# Altium project SensorBoard.PrjPcb
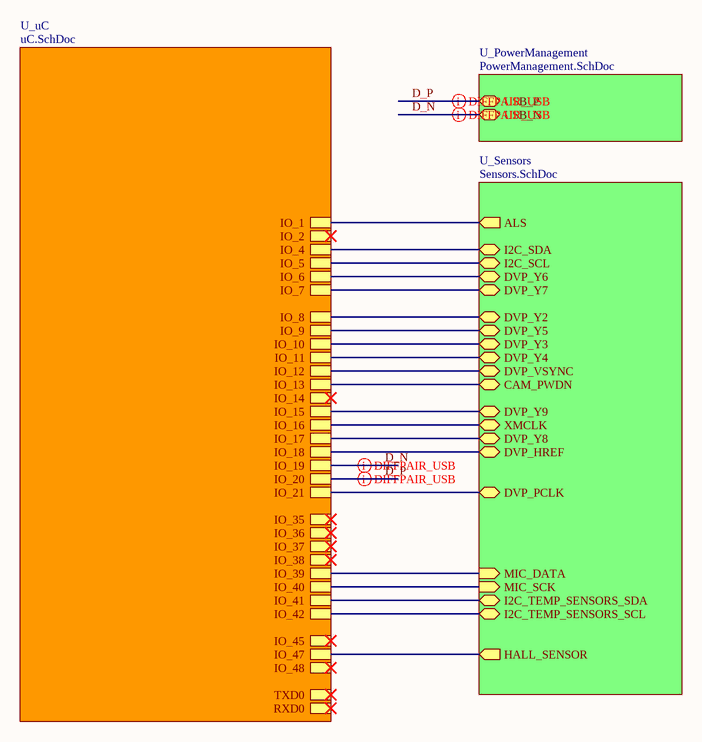
[diagram p0: Main.SchDoc]
Author_in3: Pablo Sanchez Bergasa; SheetTotal_in3: 10
4 sheets, 66 parts. Net scope: hierarchical (ports join the sheet entries above them; power ports are global).
Board file: SensorBoard.PcbDoc
Sheets:
  Main.SchDoc
    U_uC = uC.SchDoc
    U_Sensors = Sensors.SchDoc
    U_PowerManagement = PowerManagement.SchDoc

## Sheet Main.SchDoc: Main
size A3; Date: 17/09/18; Author: Pablo Sánchez Bergasa; Revision: 2.A.1; SheetNumber: 1; SheetTotal: 4; DocumentName: Main

### Sub-sheets
U_PowerManagement = PowerManagement.SchDoc: USB_P (bidir), USB_N (bidir)
U_Sensors = Sensors.SchDoc: MIC_SCK (in), MIC_DATA (in), I2C_SDA (bidir), I2C_SCL (bidir), ALS (out), I2C_TEMP_SENSORS_SDA (bidir), I2C_TEMP_SENSORS_SCL (bidir), HALL_SENSOR (out), DVP_VSYNC (bidir), DVP_HREF (bidir), DVP_Y2 (bidir), DVP_Y3 (bidir), DVP_Y7 (bidir), DVP_Y9 (bidir), XMCLK (bidir), DVP_PCLK (bidir), DVP_Y4 (bidir), DVP_Y6 (bidir), CAM_PWDN (bidir), DVP_Y8 (bidir), DVP_Y5 (bidir)
U_uC = uC.SchDoc: IO_4, IO_5, IO_35, IO_6, IO_7, IO_8, IO_9, IO_10, IO_11, IO_12, IO_13, IO_14, IO_15, IO_16, IO_17, IO_18, IO_19, IO_20, IO_21, IO_36, IO_37, IO_38, IO_1, IO_2, TXD0, RXD0, IO_39, IO_40, IO_41, IO_42, IO_47, IO_48, IO_45

### Nets
D_N: sheet U_uC/IO_19, sheet U_PowerManagement/USB_N
D_P: sheet U_uC/IO_20, sheet U_PowerManagement/USB_P
SCL: sheet U_uC/IO_5, sheet U_Sensors/I2C_SCL
SCL_TS: sheet U_uC/IO_42, sheet U_Sensors/I2C_TEMP_SENSORS_SCL
SDA: sheet U_uC/IO_4, sheet U_Sensors/I2C_SDA
SDA_TS: sheet U_uC/IO_41, sheet U_Sensors/I2C_TEMP_SENSORS_SDA
NetJ2_3: sheet U_uC/IO_11, sheet U_Sensors/DVP_Y4
NetJ2_4: sheet U_uC/IO_10, sheet U_Sensors/DVP_Y3
NetJ2_5: sheet U_uC/IO_9, sheet U_Sensors/DVP_Y5
NetJ2_6: sheet U_uC/IO_8, sheet U_Sensors/DVP_Y2
NetJ2_7: sheet U_uC/IO_6, sheet U_Sensors/DVP_Y6
NetJ2_8: sheet U_uC/IO_21, sheet U_Sensors/DVP_PCLK
NetJ2_9: sheet U_uC/IO_7, sheet U_Sensors/DVP_Y7
NetJ2_11: sheet U_uC/IO_17, sheet U_Sensors/DVP_Y8
NetJ2_12: sheet U_uC/IO_16, sheet U_Sensors/XMCLK
NetJ2_13: sheet U_uC/IO_15, sheet U_Sensors/DVP_Y9
NetJ2_16: sheet U_uC/IO_18, sheet U_Sensors/DVP_HREF
NetJ2_17: sheet U_uC/IO_13, sheet U_Sensors/CAM_PWDN
NetJ2_18: sheet U_uC/IO_12, sheet U_Sensors/DVP_VSYNC
NetR7_2: sheet U_uC/IO_1, sheet U_Sensors/ALS
NetU1_24: sheet U_uC/IO_47, sheet U_Sensors/HALL_SENSOR
NetU1_32: sheet U_uC/IO_39, sheet U_Sensors/MIC_DATA
NetU1_33: sheet U_uC/IO_40, sheet U_Sensors/MIC_SCK

### Layout directives
differential pair; differential pair class USB: D_N, D_P

### Notes on the sheet
- Title
- Size:
- Date:
- A3
- Author:
- Time:
- Revision:
- Sheet
- of
- File:

## Sheet uC.SchDoc: uC
size A3; SheetNumber: 3; SheetTotal: 4
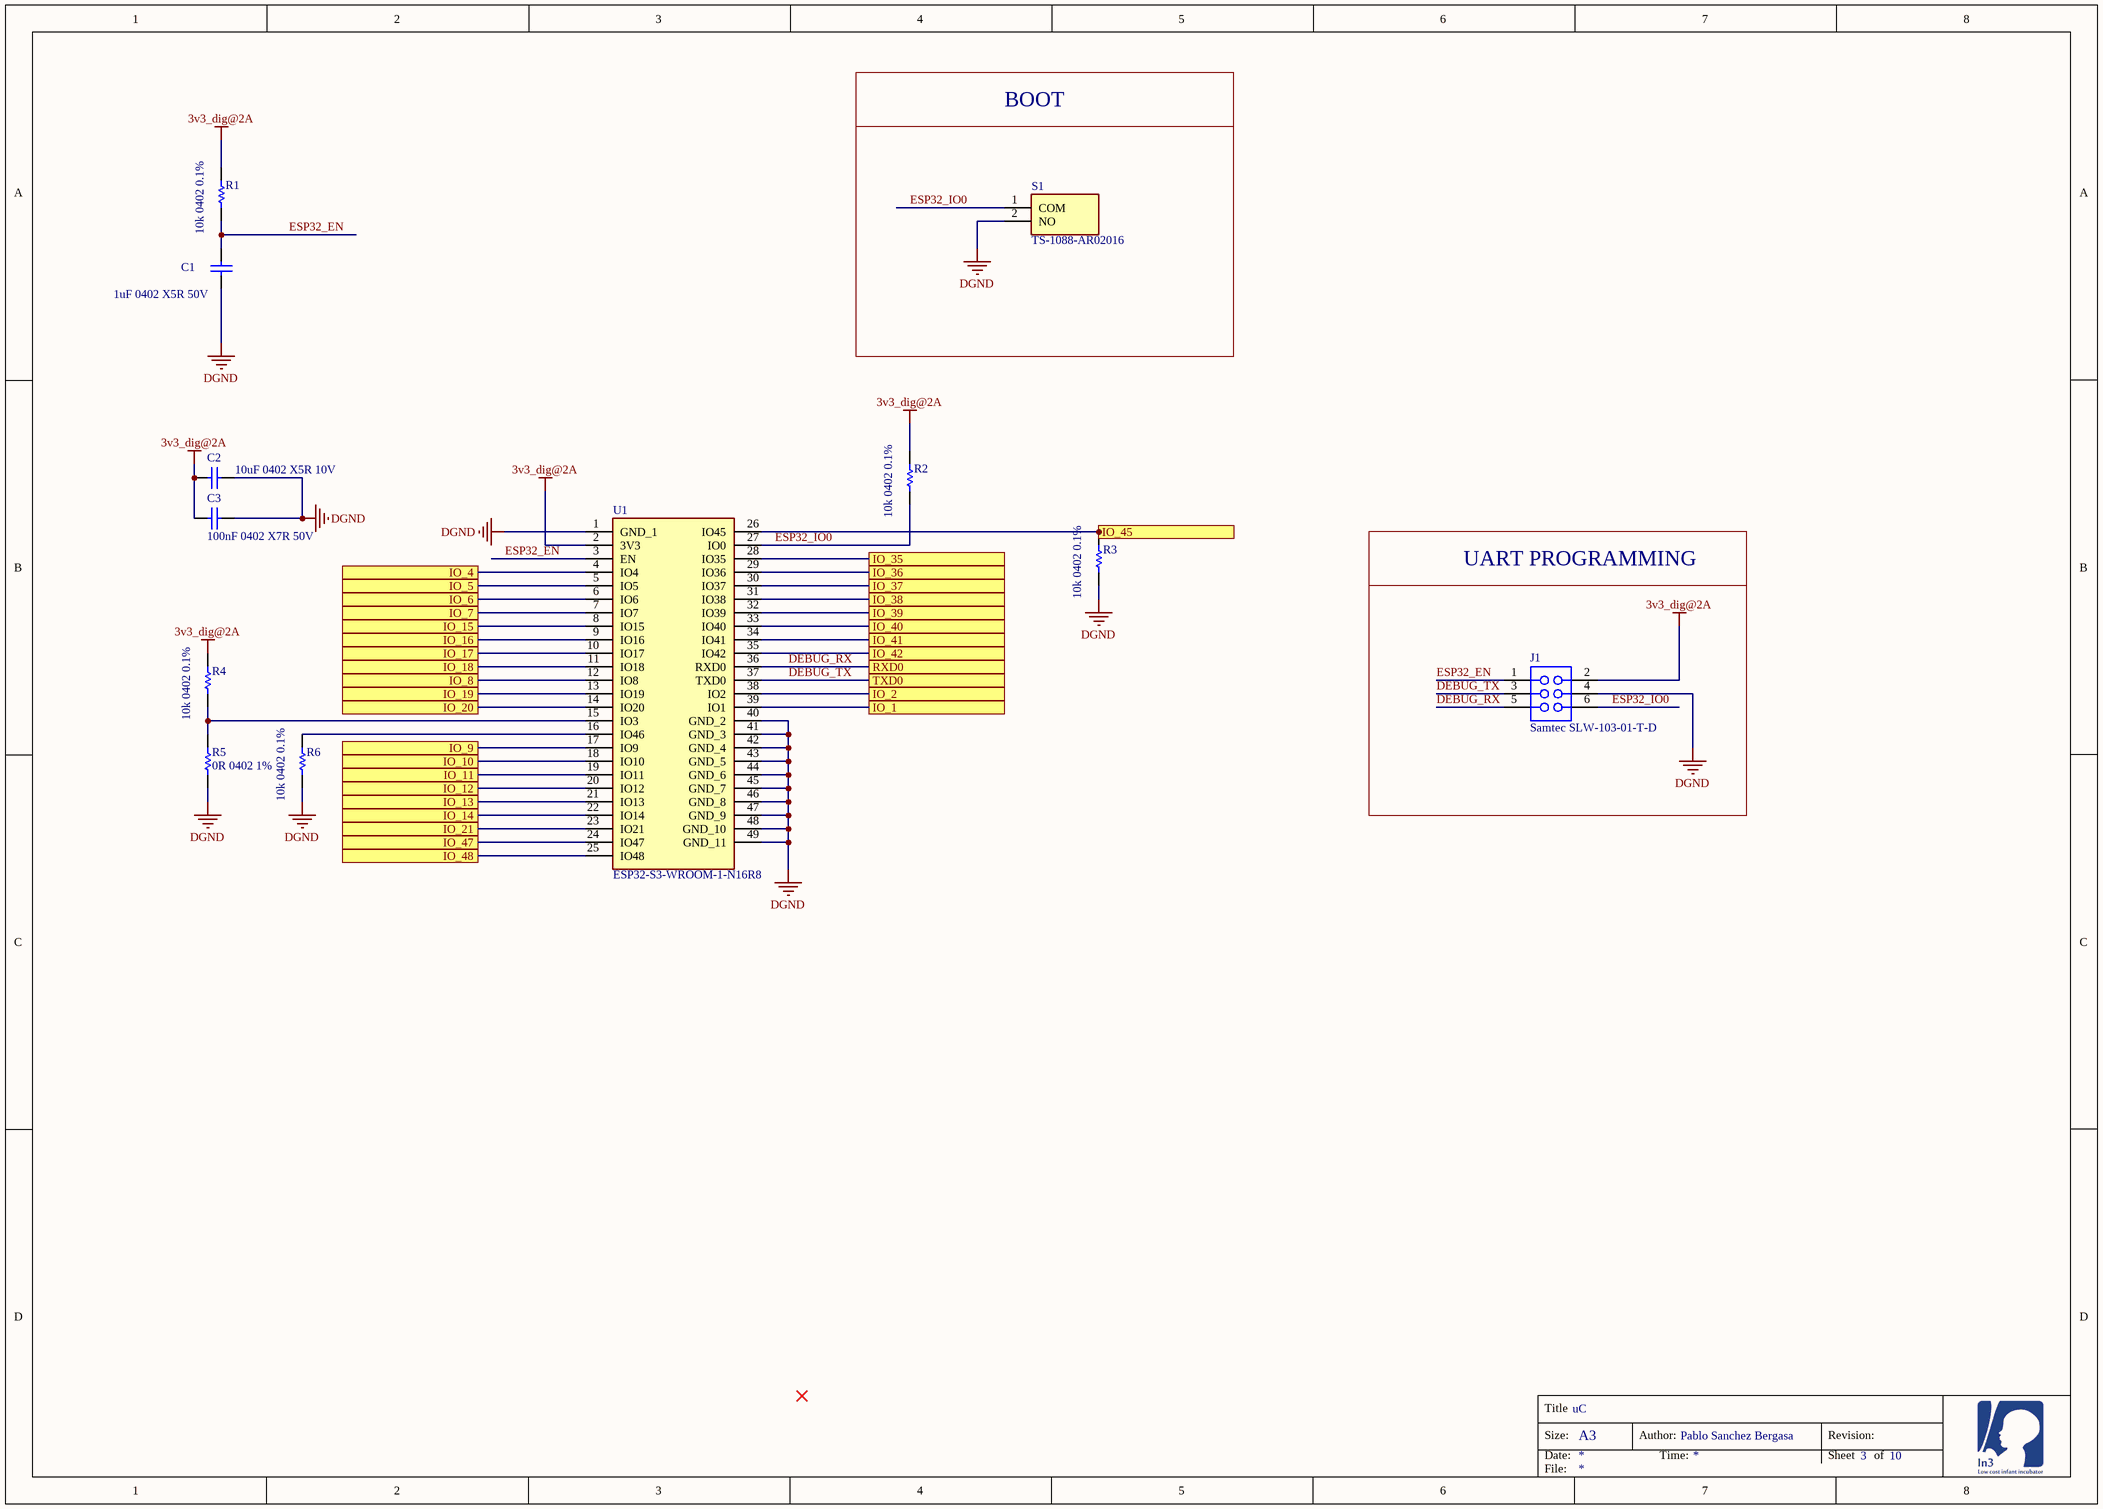
[diagram p1: uC.SchDoc]

### Parts
C1  1uF 0402 X5R 50V  [CAPC1005X55X25NL5T10]
C2  10uF 0402 X5R 10V  [CAPC1005X55X25NL5T10]
C3  100nF 0402 X7R 50V  [CAPC1005X55X25NL5T10]
J1  Samtec SLW-103-01-T-D  [PCB-37z8hw1ej4f71bosen9e-1]
R1  10k 0402 0.1%  [RESC1005X40X25ML05T10]
R2  10k 0402 0.1%  [RESC1005X40X25ML05T10]
R3  10k 0402 0.1%  [RESC1005X40X25ML05T10]
R4  10k 0402 0.1%  [RESC1005X40X25ML05T10]
R5  0R 0402 1%  [RESC1005X40X25ML05T10]
R6  10k 0402 0.1%  [RESC1005X40X25ML05T10]
S1  TS-1088-AR02016  [TS1088AR02016]
U1  ESP32-S3-WROOM-1-N16R8  [ESP32S3WROOM1N16R8]

### Blocks framed on the sheet
BOOT: S1
UART PROGRAMMING: J1

### Ports
IO_1, IO_2, IO_4, IO_5, IO_6, IO_7, IO_8, IO_9, IO_10, IO_11, IO_12, IO_13, IO_14, IO_15, IO_16, IO_17, IO_18, IO_19, IO_20, IO_21, IO_35, IO_36, IO_37, IO_38, IO_39, IO_40, IO_41, IO_42, IO_45, IO_47, IO_48, RXD0, TXD0

### Nets
3v3_dig@2A: C2.2 C3.2 J1.2 R1.2 R2.2 R4.2 U1.2(3V3)
DGND: C1.1 C2.1 C3.1 J1.4 R3.1 R5.2 R6.1 S1.2(NO) U1.1(GND_1) U1.40(GND_2) U1.41(GND_3) U1.42(GND_4) U1.43(GND_5) U1.44(GND_6) U1.45(GND_7) U1.46(GND_8) U1.47(GND_9) U1.48(GND_10) U1.49(GND_11)
D_N: U1.13(IO19) ; port IO_19
D_P: U1.14(IO20) ; port IO_20
DEBUG_RX: J1.5 U1.36(RXD0) ; port RXD0
DEBUG_TX: J1.3 U1.37(TXD0) ; port TXD0
ESP32_EN: C1.2 J1.1 R1.1 U1.3(EN)
ESP32_IO0: J1.6 R2.1 S1.1(COM) U1.27(IO0)
SCL: U1.5(IO5) ; port IO_5
SCL_TS: U1.35(IO42) ; port IO_42
SDA: U1.4(IO4) ; port IO_4
SDA_TS: U1.34(IO41) ; port IO_41
NetJ2_3: U1.19(IO11) ; port IO_11
NetJ2_4: U1.18(IO10) ; port IO_10
NetJ2_5: U1.17(IO9) ; port IO_9
NetJ2_6: U1.12(IO8) ; port IO_8
NetJ2_7: U1.6(IO6) ; port IO_6
NetJ2_8: U1.23(IO21) ; port IO_21
NetJ2_9: U1.7(IO7) ; port IO_7
NetJ2_11: U1.10(IO17) ; port IO_17
NetJ2_12: U1.9(IO16) ; port IO_16
NetJ2_13: U1.8(IO15) ; port IO_15
NetJ2_16: U1.11(IO18) ; port IO_18
NetJ2_17: U1.21(IO13) ; port IO_13
NetJ2_18: U1.20(IO12) ; port IO_12
NetR3_2: R3.2 U1.26(IO45) ; port IO_45
NetR4_1: R4.1 R5.1 U1.15(IO3)
NetR6_2: R6.2 U1.16(IO46)
NetR7_2: U1.39(IO1) ; port IO_1
NetU1_22: U1.22(IO14) ; port IO_14
NetU1_24: U1.24(IO47) ; port IO_47
NetU1_25: U1.25(IO48) ; port IO_48
NetU1_28: U1.28(IO35) ; port IO_35
NetU1_29: U1.29(IO36) ; port IO_36
NetU1_30: U1.30(IO37) ; port IO_37
NetU1_31: U1.31(IO38) ; port IO_38
NetU1_32: U1.32(IO39) ; port IO_39
NetU1_33: U1.33(IO40) ; port IO_40
NetU1_38: U1.38(IO2) ; port IO_2

### Notes on the sheet
- Title
- Size:
- Date:
- A3
- Author:
- Time:
- Revision:
- Sheet
- of
- File:

### Library data of the parts
C1-C3 = CMP-1662-00020-1: ComponentLink2Description: Datasheet; ComponentLink2URL: http://psearch.en.murata.com/capacitor/product/GRM155R60J105KE19%23.pdf; ComponentLink1Description: Manufacturer URL; ComponentLink1URL: http://www.murata.com/
  C1: LCSC_PN: C1518208
  C2: LCSC_PN: C77000
  C3: LCSC_PN: C77020
J1 = CMP-bcf575fbeff46332-1: Dual Row Connector Female Samtec SLW-103-01-T-D; Lead-Free Status: Lead Free; Number of Contacts: 6; Pin Pitch: 2.54 mm; Voltage Rating (AC): 400 V; Gender: Female; Color: Black; Octopart URL: https://octopart.com/slw-103-01-t-d-samtec-292455; Mounting Style: Through Hole, Vertical; Contact Plating: Tin; OctopartID: bcf575fbeff46332; Operating Temperature: 105 °C (max); Size-Width: 4.95 mm; Housing Material: Plastic; Size-Length: 7.62 mm; Number of Rows: 2; Size-Height: 4.57 mm; Packaging: Tube; RoHS: Compliant; Contact Material: Phosphor Bronze; Number of Positions: 6; Housing Color: Black; REACH SVHC Compliance: No SVHC; Manufacturer Part Number: SLW-103-01-T-D; LCSC_PN: C492420
R1-R6 = CMP-2002-07472-1
  R1-R4 R6: LCSC_PN: C190095
  R5: LCSC_PN: C60485
S1 = TS-1088-AR02016: Switch; Manufacturer_Name: XUNPU; Datasheet Link: https://www.xunpudianzi.com/uploads/pdf/TS-1088-ARXXX.pdf; Height: 2mm; Manufacturer_Part_Number: TS-1088-AR02016; LCSC_PN: C720477
U1 = ESP32-S3-WROOM-1-N16R8: Integrated Circuit; Manufacturer_Name: Espressif Systems; Datasheet Link: https://www.espressif.com/sites/default/files/documentation/esp32-s3-wroom-1_wroom-1u_datasheet_en.pdf; Height: 3.25mm; Manufacturer_Part_Number: ESP32-S3-WROOM-1-N16R8; Mouser Part Number: 356-ESP32S3WRM1N16R8; Mouser Price/Stock: https://www.mouser.co.uk/ProductDetail/Espressif-Systems/ESP32-S3-WROOM-1-N16R8?qs=Li%252BoUPsLEnvQc9gW6AMhZg%3D%3D; LCSC_PN: C2913202

## Sheet Sensors.SchDoc: Sensors
size A3; SheetNumber: 4; SheetTotal: 4
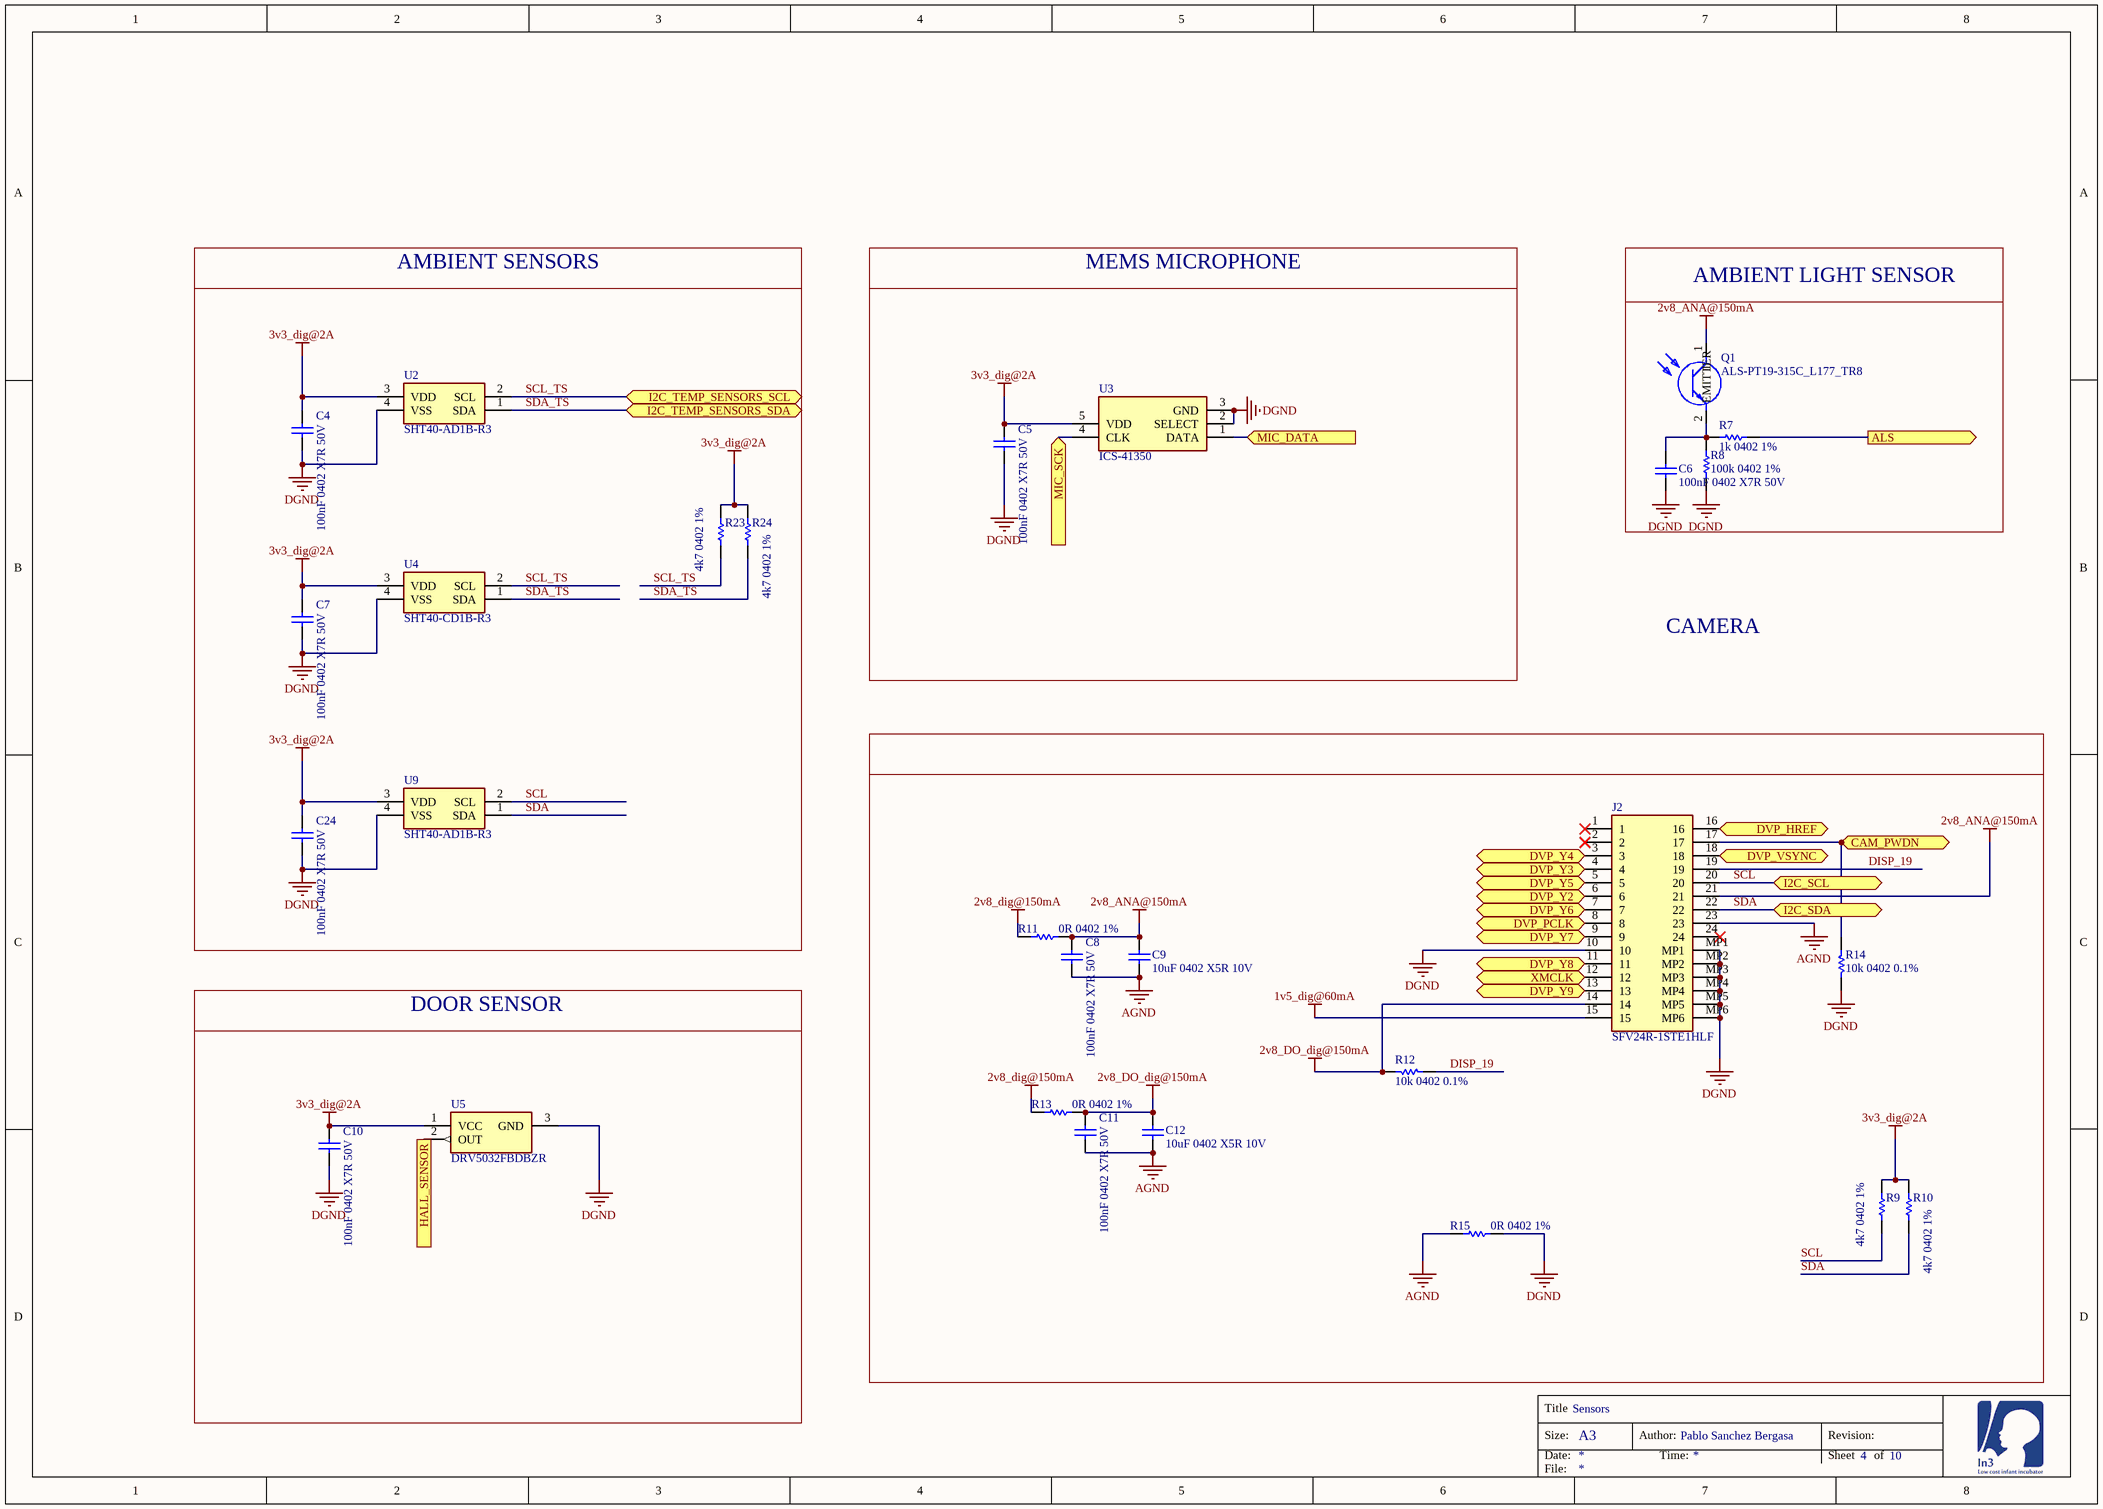
[diagram p2: Sensors.SchDoc]

### Parts
C4  100nF 0402 X7R 50V  [CAPC1005X55X25NL5T10]
C5  100nF 0402 X7R 50V  [CAPC1005X55X25NL5T10]
C6  100nF 0402 X7R 50V  [CAPC1005X55X25NL5T10]
C7  100nF 0402 X7R 50V  [CAPC1005X55X25NL5T10]
C8  100nF 0402 X7R 50V  [CAPC1005X55X25NL5T10]
C9  10uF 0402 X5R 10V  [CAPC1005X55X25NL5T10]
C10  100nF 0402 X7R 50V  [CAPC1005X55X25NL5T10]
C11  100nF 0402 X7R 50V  [CAPC1005X55X25NL5T10]
C12  10uF 0402 X5R 10V  [CAPC1005X55X25NL5T10]
C24  100nF 0402 X7R 50V  [CAPC1005X55X25NL5T10]
J2  SFV24R-1STE1HLF  [SFV24R1STE1HLF]
Q1  ALS-PT19-315C_L177_TR8  [ALSPT19315CL177TR8]
R7  1k 0402 1%  [RESC1005X40X25ML05T10]
R8  100k 0402 1%  [RESC1005X40X25ML05T10]
R9  4k7 0402 1%  [RESC1005X40X25ML05T10]
R10  4k7 0402 1%  [RESC1005X40X25ML05T10]
R11  0R 0402 1%  [RESC1005X40X25ML05T10]
R12  10k 0402 0.1%  [RESC1005X40X25ML05T10]
R13  0R 0402 1%  [RESC1005X40X25ML05T10]
R14  10k 0402 0.1%  [RESC1005X40X25ML05T10]
R15  0R 0402 1%  [RESC1005X40X25ML05T10]
R23  4k7 0402 1%  [RESC1005X40X25ML05T10]
R24  4k7 0402 1%  [RESC1005X40X25ML05T10]
U2  SHT40-AD1B-R3  [SHT40AD1BR3]
U3  ICS-41350  [ICS41352]
U4  SHT40-CD1B-R3  [SHT40CD1BR3]
U5  DRV5032FBDBZR  [SOT95P237X95-3N]
U9  SHT40-AD1B-R3  [SHT40AD1BR3]

### Blocks framed on the sheet
AMBIENT SENSORS: C4 C7 C24 R23 R24 U2 U4 U9
MEMS MICROPHONE: C5 U3
AMBIENT LIGHT SENSOR: C6 Q1 R7 R8
DOOR SENSOR: C10 U5

### Ports
ALS (out), CAM_PWDN (bidir), DVP_HREF (bidir), DVP_PCLK (bidir), DVP_VSYNC (bidir), DVP_Y2 (bidir), DVP_Y3 (bidir), DVP_Y4 (bidir), DVP_Y5 (bidir), DVP_Y6 (bidir), DVP_Y7 (bidir), DVP_Y8 (bidir), DVP_Y9 (bidir), HALL_SENSOR (out), I2C_SCL (bidir), I2C_SDA (bidir), I2C_TEMP_SENSORS_SCL (bidir), I2C_TEMP_SENSORS_SDA (bidir), MIC_DATA (in), MIC_SCK (in), XMCLK (bidir)

### Nets
1v5_dig@60mA: J2.15
2v8_ANA@150mA: C8.2 C9.1 J2.21 Q1.1 R11.1
2v8_dig@150mA: R11.2 R13.2
2v8_DO_dig@150mA: C11.2 C12.1 J2.14 R12.2 R13.1
3v3_dig@2A: C4.2 C5.2 C7.2 C10.2 C24.2 R9.1 R10.1 R23.1 R24.1 U2.3(VDD) U3.5(VDD) U4.3(VDD) U5.1(VCC) U9.3(VDD)
AGND: C8.1 C9.2 C11.1 C12.2 J2.23 R15.2
DGND: C4.1 C5.1 C6.2 C7.1 C10.1 C24.1 J2.10 J2.MP1 J2.MP2 J2.MP3 J2.MP4 J2.MP5 J2.MP6 R8.2 R14.2 R15.1 U2.4(VSS) U3.2(SELECT) U3.3(GND) U4.4(VSS) U5.3(GND) U9.4(VSS)
DISP_19: J2.19 R12.1
SCL: J2.20 R9.2 U9.2(SCL) ; port I2C_SCL
SCL_TS: R23.2 U2.2(SCL) U4.2(SCL) ; port I2C_TEMP_SENSORS_SCL
SDA: J2.22 R10.2 U9.1(SDA) ; port I2C_SDA
SDA_TS: R24.2 U2.1(SDA) U4.1(SDA) ; port I2C_TEMP_SENSORS_SDA
NetC6_1: C6.1 Q1.2(EMITTER) R7.1 R8.1
NetJ2_3: J2.3 ; port DVP_Y4
NetJ2_4: J2.4 ; port DVP_Y3
NetJ2_5: J2.5 ; port DVP_Y5
NetJ2_6: J2.6 ; port DVP_Y2
NetJ2_7: J2.7 ; port DVP_Y6
NetJ2_8: J2.8 ; port DVP_PCLK
NetJ2_9: J2.9 ; port DVP_Y7
NetJ2_11: J2.11 ; port DVP_Y8
NetJ2_12: J2.12 ; port XMCLK
NetJ2_13: J2.13 ; port DVP_Y9
NetJ2_16: J2.16 ; port DVP_HREF
NetJ2_17: J2.17 R14.1 ; port CAM_PWDN
NetJ2_18: J2.18 ; port DVP_VSYNC
NetR7_2: R7.2 ; port ALS
NetU1_24: U5.2(OUT) ; port HALL_SENSOR
NetU1_32: U3.1(DATA) ; port MIC_DATA
NetU1_33: U3.4(CLK) ; port MIC_SCK

Not connected (* = marked no-connect by the designer): J2 1* 2* 24*

### Notes on the sheet
- CAMERA
- Title
- Size:
- Date:
- A3
- Author:
- Time:
- Revision:
- Sheet
- of
- File:

### Library data of the parts
C4-C12 C24 = CMP-1662-00020-1: ComponentLink2Description: Datasheet; ComponentLink2URL: http://psearch.en.murata.com/capacitor/product/GRM155R60J105KE19%23.pdf; ComponentLink1Description: Manufacturer URL; ComponentLink1URL: http://www.murata.com/
  C4-C8 C10 C11 C24: LCSC_PN: C77020
  C9 C12: LCSC_PN: C77000
J2 = SFV24R-1STE1HLF: Connector; Manufacturer_Name: Amphenol Communications Solutions; Datasheet Link: https://cdn.amphenol-cs.com/media/wysiwyg/files/drawing/10112793.pdf; Height: 2mm; Manufacturer_Part_Number: SFV24R-1STE1HLF; LCSC_PN: C599469
Q1 = ALS-PT19-315C_L177_TR8: Phototransistor; Manufacturer_Name: Everlight; Manufacturer_Part_Number: ALS-PT19-315C/L177/TR8; Datasheet Link: https://www.digikey.ph/en/products/detail/everlight-electronics-co-ltd/ALS-PT19-315C-L177-TR8/2675735?srsltid=AfmBOopkZAWRkSRGF2QkCTJg8jlOMXuDkqdJQuZk5-RcBTTXcrGGKyht; Height: 0mm; Mouser Part Number: 638-ALSPT19315CL177; Mouser Price/Stock: https://www.mouser.co.uk/ProductDetail/Everlight/ALS-PT19-315C-L177-TR8?qs=8PzhAHr7IdN7OeHhwLrtPw%3D%3D; Arrow Part Number: ALS-PT19-315C/L177/TR8; Arrow Price/Stock: https://www.arrow.com/en/products/als-pt19-315cl177tr8/everlight-electronics?utm_currency=USD&region=europe; LCSC_PN: C146233
R7-R15 R23 R24 = CMP-2002-07472-1
  R7: LCSC_PN: C106235
  R8: LCSC_PN: C60491
  R9 R10 R23 R24: LCSC_PN: C105871
  R11 R13 R15: LCSC_PN: C60485
  R12 R14: LCSC_PN: C190095
U2 U9 = SHT40-AD1B-R3: Integrated Circuit; Manufacturer_Name: Sensirion; Datasheet Link: https://www.arrow.com/en/products/sht40-ad1b-r3/sensirion-ag; Height: 0.59mm; Manufacturer_Part_Number: SHT40-AD1B-R3; Mouser Part Number: 403-SHT40-AD1B-R3; Mouser Price/Stock: https://www.mouser.co.uk/ProductDetail/Sensirion/SHT40-AD1B-R3?qs=zW32dvEIR3sa7U6cFW6pBw%3D%3D; Arrow Part Number: SHT40-AD1B-R3; Arrow Price/Stock: https://www.arrow.com/en/products/sht40-ad1b-r3/sensirion-ag?utm_currency=USD&region=asia; LCSC_PN: C2848306
U3 = ICS-41350: Integrated Circuit; Manufacturer_Name: TDK; Datasheet Link: https://product.tdk.com/system/files/dam/doc/product/sw_piezo/mic/mems-mic/data_sheet/ds-000048-ics-41352-data-sheet-v1.0.pdf; Height: 1.13mm; Manufacturer_Part_Number: ICS-41350; Mouser Part Number: 410-ICS-41350; Mouser Price/Stock: https://www.mouser.co.uk/ProductDetail/TDK-InvenSense/ICS-41350?qs=u4fy%2FsgLU9MU%252BiFhvX73lg%3D%3D; Arrow Part Number: ICS-41350; Arrow Price/Stock: https://www.arrow.com/en/products/ics-41350/invensense.html?utm_currency=USD&region=nac; LCSC_PN: C3171856
U4 = SHT40-CD1B-R3: Integrated Circuit; Manufacturer_Name: Sensirion; Datasheet Link: https://sensirion.com/media/documents/33FD6951/6555C40E/Sensirion_Datasheet_SHT4x.pdf; Height: 0.59mm; Manufacturer_Part_Number: SHT40-CD1B-R3; Mouser Part Number: 403-SHT40-CD1B-R3; Mouser Price/Stock: https://www.mouser.co.uk/ProductDetail/Sensirion/SHT40-CD1B-R3?qs=ulEaXIWI0c%2FeyXO6eo5KrQ%3D%3D; Arrow Part Number: SHT40-CD1B-R3; Arrow Price/Stock: https://www.arrow.com/en/products/sht40-cd1b-r3/sensirion-ag?utm_currency=USD&region=nac; LCSC_PN: C7461852
U5 = DRV5032FBDBZR: Integrated Circuit; Manufacturer_Name: Texas Instruments; Datasheet Link: http://www.ti.com/lit/gpn/drv5032; Height: 0.95mm; Manufacturer_Part_Number: DRV5032FBDBZR; Mouser Part Number: 595-DRV5032FBDBZR; Mouser Price/Stock: https://www.mouser.co.uk/ProductDetail/Texas-Instruments/DRV5032FBDBZR?qs=u4fy%2FsgLU9MVJlgotSzybA%3D%3D; Arrow Part Number: DRV5032FBDBZR; Arrow Price/Stock: https://www.arrow.com/en/products/drv5032fbdbzr/texas-instruments?region=nac; LCSC_PN: C2655033

## Sheet PowerManagement.SchDoc: Power
size A3; SheetNumber: 2; SheetTotal: 4
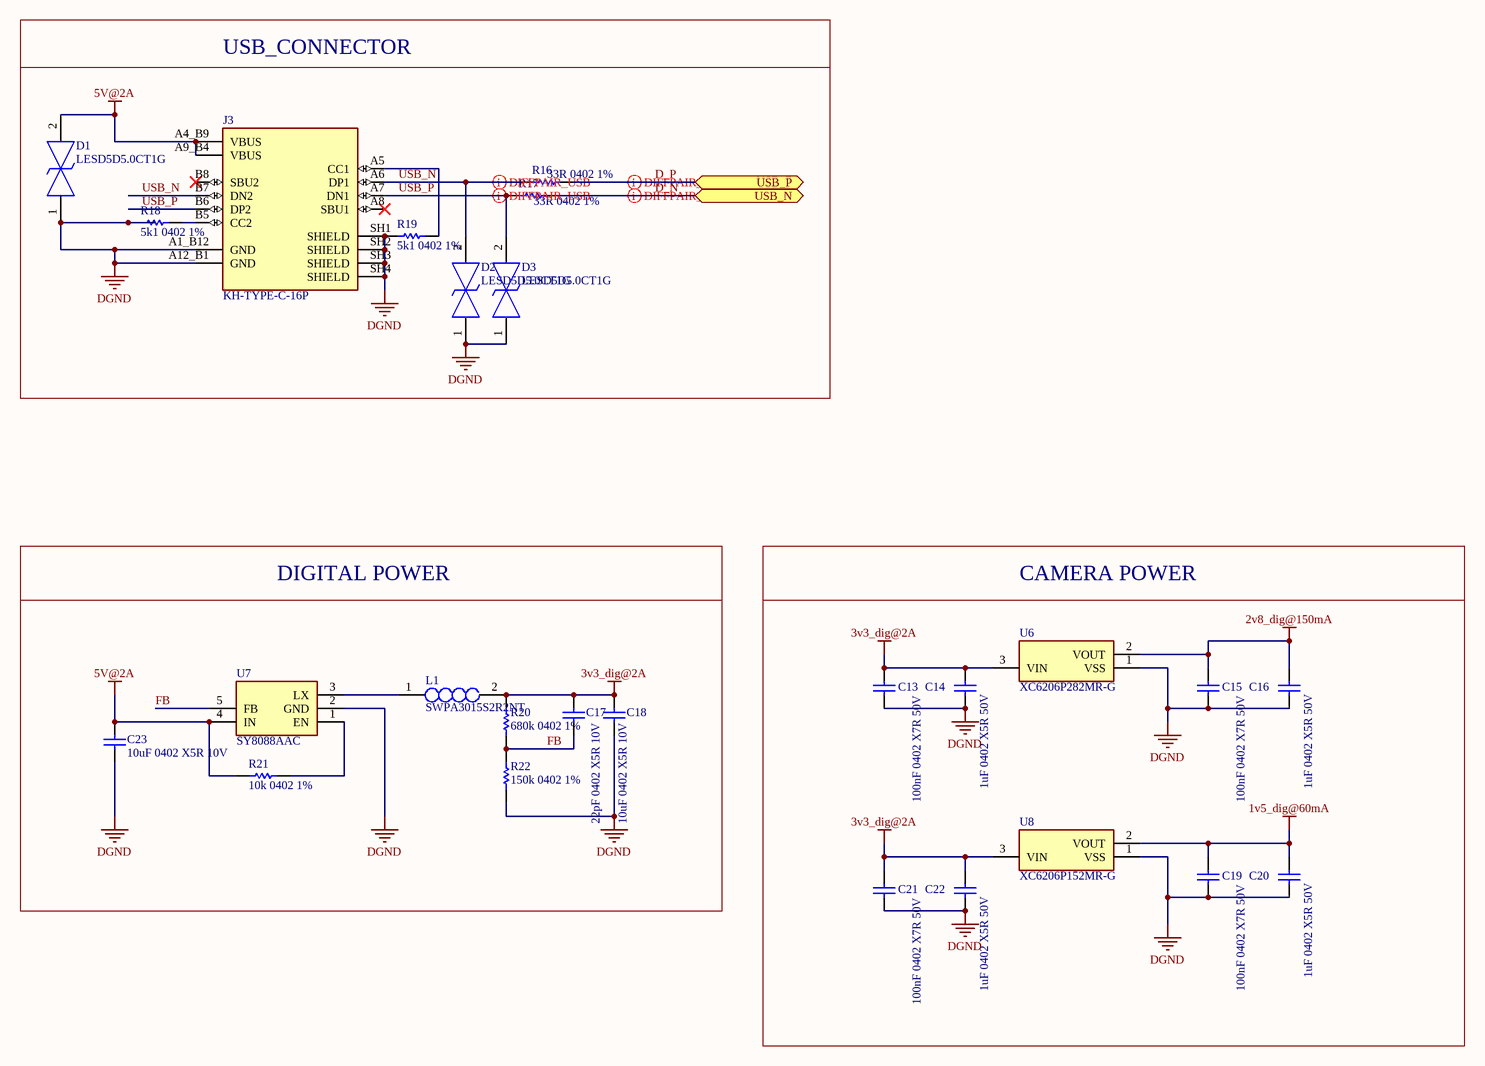
[diagram p3: PowerManagement.SchDoc]

### Parts
C13  100nF 0402 X7R 50V  [CAPC1005X55X25NL5T10]
C14  1uF 0402 X5R 50V  [CAPC1005X55X25NL5T10]
C15  100nF 0402 X7R 50V  [CAPC1005X55X25NL5T10]
C16  1uF 0402 X5R 50V  [CAPC1005X55X25NL5T10]
C17  22pF 0402 X5R 10V  [CAPC1005X55X25NL5T10]
C18  10uF 0402 X5R 10V  [CAPC1005X55X25NL5T10]
C19  100nF 0402 X7R 50V  [CAPC1005X55X25NL5T10]
C20  1uF 0402 X5R 50V  [CAPC1005X55X25NL5T10]
C21  100nF 0402 X7R 50V  [CAPC1005X55X25NL5T10]
C22  1uF 0402 X5R 50V  [CAPC1005X55X25NL5T10]
C23  10uF 0402 X5R 10V  [CAPC1005X55X25NL5T10]
D1  LESD5D5.0CT1G  [LESD5D50CT1G]
D2  LESD5D5.0CT1G  [LESD5D50CT1G]
D3  LESD5D5.0CT1G  [LESD5D50CT1G]
J3  KH-TYPE-C-16P  [KINGHELM_KH-TYPE-C-16P]
L1  SWPA3015S2R2NT  [INDPM3030X150N]
R16  33R 0402 1%  [RESC1005X40X25ML05T10]
R17  33R 0402 1%  [RESC1005X40X25ML05T10]
R18  5k1 0402 1%  [RESC1005X40X25ML05T10]
R19  5k1 0402 1%  [RESC1005X40X25ML05T10]
R20  680k 0402 1%  [RESC1005X40X25ML05T10]
R21  10k 0402 1%  [RESC1005X40X25ML05T10]
R22  150k 0402 1%  [RESC1005X40X25ML05T10]
U6  XC6206P282MR-G  [SOT95P280X130-3N]
U7  SY8088AAC  [SOT95P285X140-5N]
U8  XC6206P152MR-G  [SOT95P280X130-3N]

### Blocks framed on the sheet
USB_CONNECTOR: D1-D3 J3 R16-R19
DIGITAL POWER: C17 C18 C23 L1 R20-R22 U7
CAMERA POWER: C13-C16 C19-C22 U6 U8

### Ports
USB_N (bidir), USB_P (bidir)

### Nets
1v5_dig@60mA: C19.2 C20.2 U8.2(VOUT)
2v8_dig@150mA: C15.2 C16.2 U6.2(VOUT)
3v3_dig@2A: C13.2 C14.2 C17.1 C18.1 C21.2 C22.2 L1.2 R20.1 U6.3(VIN) U8.3(VIN)
5V@2A: C23.1 D1.2 J3.A4_B9(VBUS) J3.A9_B4(VBUS) R21.1 U7.4(IN)
DGND: C13.1 C14.1 C15.1 C16.1 C18.2 C19.1 C20.1 C21.1 C22.1 C23.2 D1.1 D2.1 D3.1 J3.A1_B12(GND) J3.A12_B1(GND) J3.SH1(SHIELD) J3.SH2(SHIELD) J3.SH3(SHIELD) J3.SH4(SHIELD) R18.1 R19.1 R22.2 U6.1(VSS) U7.2(GND) U8.1(VSS)
D_N: R17.2 ; port USB_N
D_P: R16.2 ; port USB_P
FB: C17.2 R20.2 R22.1 U7.5(FB)
USB_N: D2.2 J3.A6(DP1) J3.B7(DN2) R16.1
USB_P: D3.2 J3.A7(DN1) J3.B6(DP2) R17.1
NetJ3_A5: J3.A5(CC1) R19.2
NetJ3_B5: J3.B5(CC2) R18.2
NetL1_1: L1.1 U7.3(LX)
NetR21_2: R21.2 U7.1(EN)

Not connected (* = marked no-connect by the designer): J3 A8(SBU1)* B8(SBU2)*

### Layout directives
differential pair; differential pair class USB: D_N, D_P, USB_N, USB_P

### Notes on the sheet
- Title
- Size:
- Date:
- A3
- Author:
- Time:
- Revision:
- Sheet
- of
- File:

### Library data of the parts
C13-C23 = CMP-1662-00020-1: ComponentLink2Description: Datasheet; ComponentLink2URL: http://psearch.en.murata.com/capacitor/product/GRM155R60J105KE19%23.pdf; ComponentLink1Description: Manufacturer URL; ComponentLink1URL: http://www.murata.com/
  C13 C15 C19 C21: LCSC_PN: C77020
  C14 C16 C20 C22: LCSC_PN: C1518208
  C17: LCSC_PN: C106203
  C18 C23: LCSC_PN: C77000
D1-D3 = LESD5D5.0CT1G: TVS Diode (Bi-directional); Manufacturer_Name: LRC; Height: 0.7mm; Manufacturer_Part_Number: LESD5D5.0CT1G; LCSC_PN: C5274290
J3 = KH-TYPE-C-16P: MF: kinghelm; SnapEDA_Link: https://www.snapeda.com/parts/KH-TYPE-C-16P/Kinghelm/view-part/?ref=snap; Package: None; Value: *; MP: KH-TYPE-C-16P; Check_prices: https://www.snapeda.com/parts/KH-TYPE-C-16P/Kinghelm/view-part/?ref=eda; LCSC_PN: C709357
L1 = SWPA3015S2R2NT: Inductor; Manufacturer_Name: SUNLORD; Datasheet Link: https://www.datasheets360.com/pdf/-6416416511052712578; Height: 1.5mm; Manufacturer_Part_Number: SWPA3015S2R2NT; LCSC_PN: C19734
R16-R22 = CMP-2002-07472-1
  R16 R17: LCSC_PN: C138002
  R18 R19: LCSC_PN: C105872
  R20: LCSC_PN: C163456
  R21: LCSC_PN: C60490
  R22: LCSC_PN: C93947
U6 = XC6206P282MR-G: Integrated Circuit; Manufacturer_Name: Torex; Datasheet Link: https://www.torexsemi.com/file/xc6206/XC6206.pdf; Height: 1.3mm; Manufacturer_Part_Number: XC6206P282MR-G; Mouser Part Number: 865-XC6206P282MR-G; Mouser Price/Stock: https://www.mouser.co.uk/ProductDetail/Torex-Semiconductor/XC6206P282MR-G?qs=AsjdqWjXhJ%2Fpd3DOBopSeA%3D%3D; LCSC_PN: C347374
U7 = SY8088AAC: Integrated Circuit; Manufacturer_Name: Silergy; Datasheet Link: https://lcsc.com/product-detail/DC-DC-Converters_Silergy_SY8088AAC_SY8088AAC_C79313.html; Height: 1.4mm; Manufacturer_Part_Number: SY8088AAC; LCSC_PN: C79313
U8 = XC6206P152MR-G: Integrated Circuit; Manufacturer_Name: Torex; Datasheet Link: https://www.torexsemi.com/file/xc6206/XC6206.pdf; Height: 1.3mm; Manufacturer_Part_Number: XC6206P152MR-G; Mouser Part Number: 865-XC6206P152MR-G; Mouser Price/Stock: https://www.mouser.co.uk/ProductDetail/Torex-Semiconductor/XC6206P152MR-G?qs=AsjdqWjXhJ%2FTdxm%252B3lQcfQ%3D%3D; LCSC_PN: C424701

## Nets that join several sheets
1v5_dig@60mA: Sensors (J2.15), PowerManagement (C19.2 C20.2 U8.2)
2v8_dig@150mA: Sensors (R11.2 R13.2), PowerManagement (C15.2 C16.2 U6.2)
3v3_dig@2A: uC (7 pins), Sensors (14 pins), PowerManagement (10 pins)
DGND: uC (19 pins), Sensors (22 pins), PowerManagement (25 pins)
D_N: uC (U1.13), PowerManagement (R17.2)
D_P: uC (U1.14), PowerManagement (R16.2)
NetJ2_3: uC (U1.19), Sensors (J2.3)
NetJ2_4: uC (U1.18), Sensors (J2.4)
NetJ2_5: uC (U1.17), Sensors (J2.5)
NetJ2_6: uC (U1.12), Sensors (J2.6)
NetJ2_7: uC (U1.6), Sensors (J2.7)
NetJ2_8: uC (U1.23), Sensors (J2.8)
NetJ2_9: uC (U1.7), Sensors (J2.9)
NetJ2_11: uC (U1.10), Sensors (J2.11)
NetJ2_12: uC (U1.9), Sensors (J2.12)
NetJ2_13: uC (U1.8), Sensors (J2.13)
NetJ2_16: uC (U1.11), Sensors (J2.16)
NetJ2_17: uC (U1.21), Sensors (J2.17 R14.1)
NetJ2_18: uC (U1.20), Sensors (J2.18)
NetR7_2: uC (U1.39), Sensors (R7.2)
NetU1_24: uC (U1.24), Sensors (U5.2)
NetU1_32: uC (U1.32), Sensors (U3.1)
NetU1_33: uC (U1.33), Sensors (U3.4)
SCL: uC (U1.5), Sensors (J2.20 R9.2 U9.2)
SCL_TS: uC (U1.35), Sensors (R23.2 U2.2 U4.2)
SDA: uC (U1.4), Sensors (J2.22 R10.2 U9.1)
SDA_TS: uC (U1.34), Sensors (R24.2 U2.1 U4.1)

## Assembly variants
Main: not fitted J1 J2 J? R3 R81 R82